# EAGLE design LiPo-Charger (EAGLE 8.2.2)
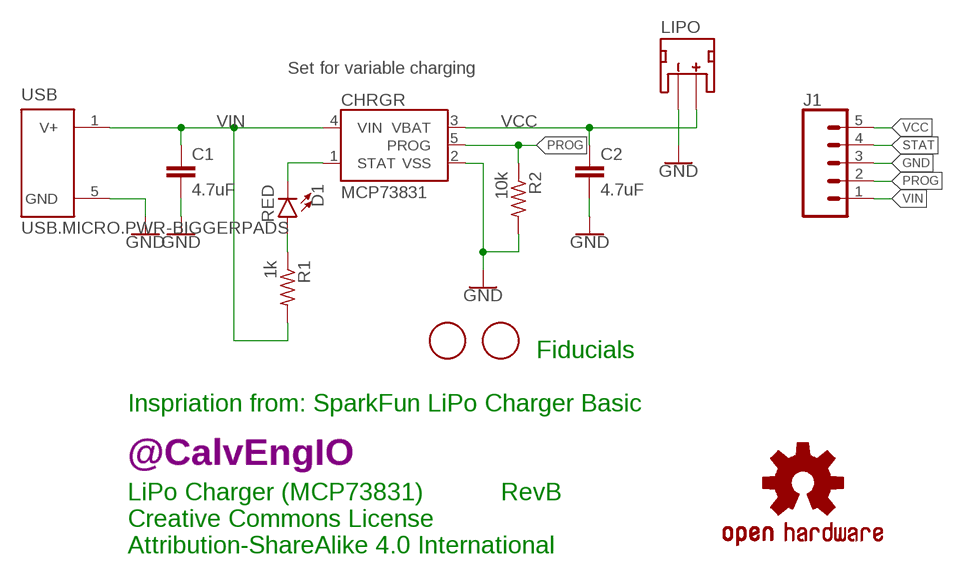
[diagram p0: schematic, sheet 1]

## Parts
C1  4.7uF  CAPACITOR0603  [C0603]
C2  4.7uF  CAPACITOR0603  [C0603]
CHRGR  MCP73831  [SOT23-5]
D1  RED  LED0603  [LED-0603]
J1  CONN_05  [1X05]
JP3  FIDUCIAL  [FIDUCIAL_1MM]
JP4  FIDUCIAL  [FIDUCIAL_1MM]
LIPO  JST_2MM_MALE  [JST-2-SMD]
LOGO1  OSHW-LOGOS  [OSHW-LOGO-S]
R1  1k  RESISTOR0402  [R0402]
R2  10k  RESISTOR0402  [R0402]
U$1  CALVENGIO_HANDLEHANDLE.08  [CALVENGIO_HANDLE.08]
USB  USB.MICRO.PWR-BIGGERPADS  [USB-MICRO-01.BIGGERPADS.PWR]

## Nets
GND: C1.2 C2.2 CHRGR.2(VSS) J1.3 LIPO.1(-) R2.2 USB.5(GND)
N$3: D1.A R1.1
PROG: CHRGR.5(PROG) J1.2 R2.1
STAT: CHRGR.1(STAT) D1.C J1.4
VCC: C2.1 CHRGR.3(VBAT) J1.5 LIPO.2(+)
VIN: C1.1 CHRGR.4(VIN) J1.1 R1.2 USB.1(V+)
Unconnected: LIPO.NC1(PAD1) LIPO.NC2(PAD2)

## Notes on the sheet
- Set for variable charging
- Fiducials
- Inspriation from: SparkFun LiPo Charger Basic
- LiPo Charger (MCP73831) | RevB
- Creative Commons License
  Attribution-ShareAlike 4.0 International

## Library data of the parts
C1 C2 = CalvEngIO-Passives:CAPACITOR
CHRGR = CalvEngIO-Power:MCP73831: MCP73831T Li-Ion, Li-Pol Controller Miniature single cell, fully integrated Li-Ion, Li-polymer charge management controller Datasheet <http://ww1.microchip.com/downloads/en/DeviceDoc/20001984g.pdf> SparkFun Products: SparkFun ESP32 Thing <https://www.sparkfun.com/products/13907> SparkFun 9DoF Razor IMU M0 <https://www.sparkfun.com/products/14001>; PROD_ID: IC-09995
D1 = CalvEngIO-LED:LED: LED (Generic) Standard schematic elements and footprints for 5mm, 3mm, 1206, and 0603 sized LEDs. Generic LEDs with no color specified. LTST-C190KGKT: arrow indicates cathode
J1 = CalvEngIO-Connectors:CONN_05: Multi connection point. Often used as Generic Header-pin footprint for 0.1 inch spaced/style header connections On any of the 0.1 inch spaced packages, you can populate with these: Break Away Headers - Straight <https://www.sparkfun.com/products/116> (PRT-00116) Break Away Male Headers - Right Angle <https://www.sparkfun.com/products/553> (PRT-00553) Female Headers <https://www.sparkfun.com/products/115> (PRT-00115) Break Away Headers - Machine Pin <https://www.sparkfun.com/products/117> (PRT-00117) Break Away Female Headers - Swiss Machine Pin <https://www.sparkfun.com/products/743> (PRT-00743) For SCREWTERMINALS and SPRING TERMINALS visit here: Screw Terimnals on SparkFun.com <https://www.sparkfun.com/search/results?term=Screw+Terminals> (5mm/3.5mm/2.54mm spacing) This device is also useful as a general connection point to wire up your design to another part of your project. Our various solder wires solder well into these plated through hole pads. Hook-Up Wire - Assortment (Stranded, 22 AWG) <https://www.sparkfun.com/products/11375> (PRT-11375) Hook-Up Wire - Assortment (Solid Core, 22 AWG) <https://www.sparkfun.com/products/11367> (PRT-11367) View the entire wire category on our website here <https://www.sparkfun.com/categories/141> Special notes: Molex polarized connector foot print use with SKU : PRT-08231 with associated crimp pins and housings. 1MM SMD Version SKU: PRT-10208
JP3 JP4 = CalvEngIO-Connectors:FIDUCIAL: For use by pick and place machines to calibrate the vision/machine, 1mm By microbuilder.eu
LIPO = CalvEngIO-Connectors:JST_2MM_MALE: JST 2MM MALE RA CONNECTOR Two pin, compact surface mount connector. Commonly used as a battery input connection point. We really like the solid locking feeling and high current rating on these small connectors. We use these all the time as battery connectors. Mates to single-cell LiPo batteries. Here is the connector we sell at SparkFun: JST Right Angle Connector - White <https://www.sparkfun.com/products/8612> (PRT-08612) Datasheet <http://www.sparkfun.com/datasheets/Prototyping/Connectors/JST-Horizontal.pdf> It was used on these SparkFun products: SparkFun MOSFET Power Controller <https://www.sparkfun.com/products/11214> (PRT-11214) SparkFun Battery Babysitter - LiPo Battery Manager <https://www.sparkfun.com/products/13777> (PRT-13777) And many, many others that required a lipo battery connection.; PROD_ID: CONN-11443; SF_ID: PRT-08612
LOGO1 = CalvEngIO-Logos:OSHW-LOGO: Open-Source Hardware (OSHW) Logo This logo indicates the piece of hardware it is found on incorporates a OSHW license and/or adheres to the definition of open source hardware found here: http://freedomdefined.org/OSHW
R1 R2 = CalvEngIO-Passives:RESISTOR
U$1 = CalvEngIO-Logos:CALVENGIO_HANDLE
USB = CalvEngIO-Connectors:USB.MICRO.PWR

## Board
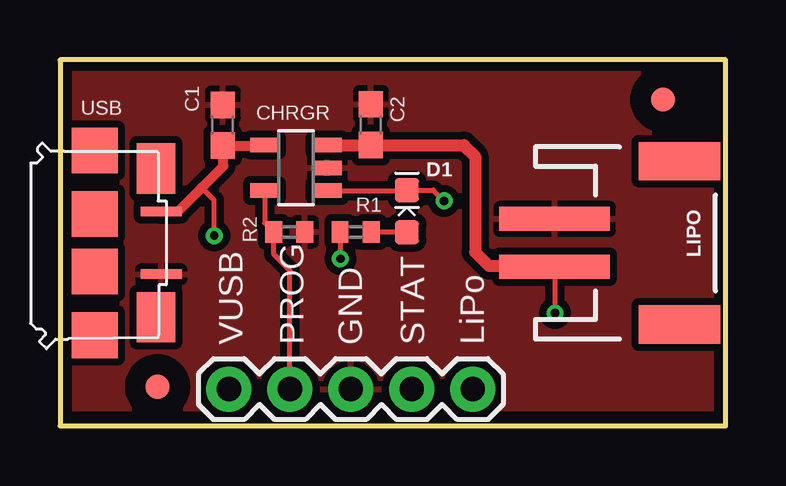
[diagram p1: board, top side]
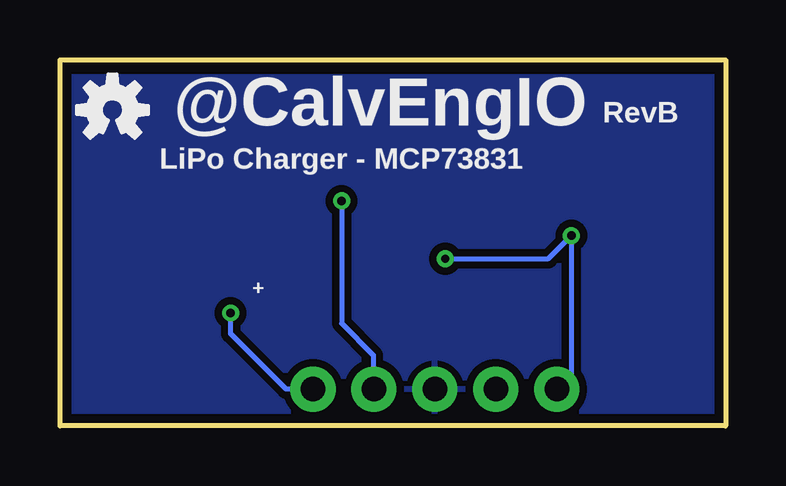
[diagram p2: board, bottom side, seen from below]

Size 27.74 x 15.24 mm. Coordinates in mm from the lower left corner, seen from the top.
Outline: 27.74,0 27.74,15.24 0,15.24 0,0 27.74,0
Copper layers (1*16): Top 0.0356mm / dielectric 1.5011mm / Bottom 0.0356mm
Design rules "LaenPCBOrder": minimum track width 6mil, minimum drill 13mil, track to track 6mil, track to pad 6mil, pad to pad 6mil, via to via 6mil, smd to smd 6mil, copper to edge 15mil, drill to drill 6mil, minimum pad ring 7mil, minimum via ring 7mil, stop-mask expansion 3mil, vias tented up to drill 0mil, thermal gap 10mil

### Footprints (pad centres in the part's own frame; a part is rotated, then mirrored left to right if it is on the bottom)
C0603 = smd 1.1 x 1: 1 -0.85,0; 2 0.85,0
SOT23-5 = smd 0.6 x 1.2: 1 -0.95,-1.306; 2 0,-1.306; 3 0.95,-1.306; 4 0.95,1.306; 5 -0.95,1.306
LED-0603 = smd 1 x 1: A -0.877,0; C 0.877,0
1X05 = drill 1.016 pad 1.88: 1 0,0; 2 2.54,0; 3 5.08,0; 4 7.62,0; 5 10.16,0
FIDUCIAL_1MM = smd 1 x 1: 1 0,0
JST-2-SMD = smd 1 x 4.6: 1 -1,-3.7; 2 1,-3.7 | smd 1.6 x 3.4: NC1 -3.4,1.5; NC2 3.4,1.5
R0402 = smd 0.7 x 0.9: 1 -0.65,0; 2 0.65,0
USB-MICRO-01.BIGGERPADS.PWR = smd 0.4 x 1.7: 1 -1.3,2.775; 5 1.3,2.775 | smd 1.9 x 1.9: SOLDER-1 -3.85,0; SOLDER-2 -1.2,0; SOLDER-3 1.2,0; SOLDER-4 3.85,0 | smd 2.1 x 1.6: SOLDER-5 -3.1,2.55; SOLDER-6 3.1,2.55

### Placement (x,y rotation side)
C1  6.78,12.52 90 top
C2  12.95,12.55 90 top
CHRGR  9.83,10.74 90 top
D1  14.45,8.94 90 top
J1  7.04,1.52 0 top
JP3  4.06,1.63 0 top
JP4  25.12,13.59 0 top
LIPO  24.31,7.62 270 top
LOGO1  25.55,13.16 0 bottom
R1  12.32,8.08 180 top
R2  9.55,8.08 0 top
U$1  14.63,13.77 0 bottom
USB  1.45,7.62 270 top

### Tracks (layer width: path | path; a pad name or v marks a point on that pad's centre or on a via)
GND
  pour Bottom (isolate 0.305): -2.59,0 -2.62,14.53 29.51,14.53 29.54,0
  pour Top (isolate 0.305): -4.24,15.24 29.67,15.24 29.67,0.71 -4.24,0.71
N$3
  Top 0.203: D1.A 12.98,8.06 R1.1
PROG
  Top 0.203: CHRGR.5 8.52,8.45 R2.1 8.89,8.07 8.92,8.04 8.92,7.14 9.58,6.48 J1.2
STAT  (via drill 0.35)
  Top 0.203: CHRGR.1 14.43,9.79 D1.C 15.56,9.82 v16,9.37
  Bottom 0.203: v16,9.37 16,4.27 14.68,2.95 14.68,1.55 J1.4
VCC  (via drill 0.35)
  Top 0.203: 20.57,6.65 | LIPO.2 20.62,6.6 v20.62,4.7
  Top 0.406: C2.1
  Top 0.508: CHRGR.3 C2.1 | C2.1 16.83,11.7 17.3,11.23 17.3,7.24 17.88,6.65 20.57,6.65
  Top 0.635: LIPO.2 20.57,6.65
  Bottom 0.203: v20.62,4.7 20.62,3.83 18.31,1.52 J1.5
VIN  (via drill 0.35)
  Top 0.203: R1.2 11.67,6.97 v11.68,6.96 | 5.91,9.92 6.43,9.4 v6.43,7.93 6.4,7.9
  Top 0.406: CHRGR.4 8.5,11.67 C1.1 6.98,11.65 6.81,11.47 6.81,10.82 5.91,9.92 4.91,8.92 USB.1
  Bottom 0.203: v11.68,6.96 7.39,6.96 v6.43,7.93 6.43,2.13 J1.1

### Text on the board
bPlace: LiPo Charger - MCP73831 | +
tNames: VUSB | PROG | GND | STAT | LiPo
bNames: RevB